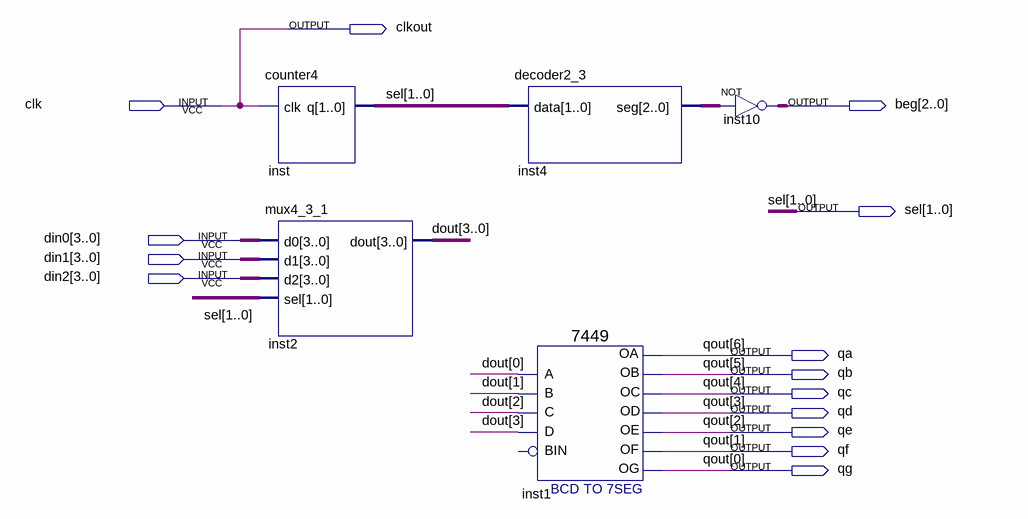
[diagram p0: schematic sheet]
// Quartus schematic scan_led3.bdf as structural Verilog: 5 symbols, 14 pins
module scan_led3 (
  input  clk,
  input  [3:0] din0,
  input  [3:0] din1,
  input  [3:0] din2,
  output clkout,
  output [2:0] beg,
  output [1:0] sel,
  output qa,
  output qb,
  output qc,
  output qd,
  output qe,
  output qf,
  output qg
);

  wire [2:0] inst4_seg;
  wire [3:0] dout;

  counter4 inst (.clk(clk), .q(sel));
  mux4_3_1 inst2 (.d0(din0), .d1(din1), .d2(din2), .sel(sel), .dout(dout));
  decoder2_3 inst4 (.data(sel), .seg(inst4_seg));
  \7449  inst1 (
    .A(dout[0]), .C(dout[2]), .B(dout[1]), .D(dout[3]), .OC(qc), .OD(qd), .OF(qf), .OG(qg), .OB(qb), .OA(qa),
    .OE(qe));  // open: BIN
  assign beg = ~inst4_seg;  // NOT inst10, 3 bits wide

  assign clkout = clk;

  // Other names for the same wires on the sheet: qout[6:0] = {qa, qb, qc, qd, qe, qf, qg}
endmodule
